# Altium schematic sheet Column.SchDoc
size A4
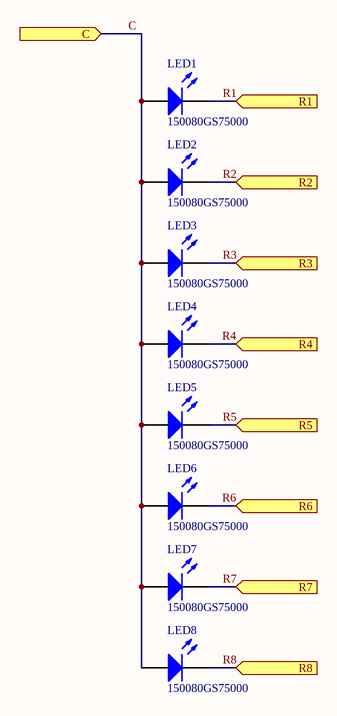
[diagram p0: Column.SchDoc]

## Parts
LED1  150080GS75000  [0805_A]
LED2  150080GS75000  [0805_A]
LED3  150080GS75000  [0805_A]
LED4  150080GS75000  [0805_A]
LED5  150080GS75000  [0805_A]
LED6  150080GS75000  [0805_A]
LED7  150080GS75000  [0805_A]
LED8  150080GS75000  [0805_A]

## Ports
C (in), R1 (in), R2 (in), R3 (in), R4 (in), R5 (in), R6 (in), R7 (in), R8 (in)

## Nets
C: LED1.2(A) LED2.2(A) LED3.2(A) LED4.2(A) LED5.2(A) LED6.2(A) LED7.2(A) LED8.2(A) ; port C
R1: LED1.1(K) ; port R1
R2: LED2.1(K) ; port R2
R3: LED3.1(K) ; port R3
R4: LED4.1(K) ; port R4
R5: LED5.1(K) ; port R5
R6: LED6.1(K) ; port R6
R7: LED7.1(K) ; port R7
R8: LED8.1(K) ; port R8

## Library data of the parts
LED1-LED8 = 150080GS75000: SMD mono-color Chip LED, WL-SMCW, Green; PackageReference: 0805_A; Color: Green; PartNumber: 150080GS75000; ComponentLink1Description: Manufacturer URL; ComponentLink1URL: http://www.we-online.com; ComponentLink2Description: Datasheet; ComponentLink2URL: http://katalog.we-online.com/led/datasheet/150080GS75000.pdf